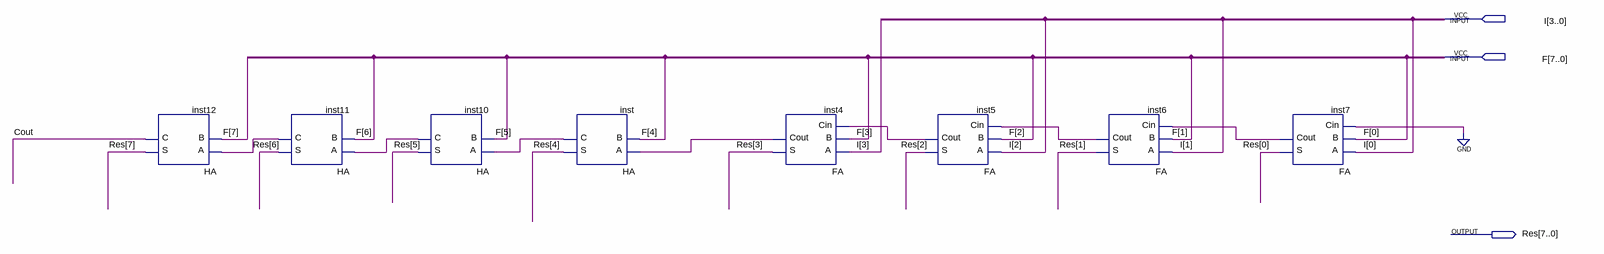
[diagram p0: schematic sheet]
// Quartus schematic Adder8_4bits.bdf as structural Verilog: 8 symbols, 3 pins
module Adder8_4bits (
  input  [3:0] I,
  input  [7:0] F,
  output [7:0] Res
);

  wire Cout, inst4_cout, inst5_cout, inst6_cout, inst7_cout, inst10_c, inst11_c, inst_c;

  HA inst12 (.A(inst11_c), .B(F[7]), .S(Res[7]), .C(Cout));
  HA inst11 (.A(inst10_c), .B(F[6]), .S(Res[6]), .C(inst11_c));
  HA inst10 (.A(inst_c), .B(F[5]), .S(Res[5]), .C(inst10_c));
  HA inst (.A(inst4_cout), .B(F[4]), .S(Res[4]), .C(inst_c));
  FA inst4 (.A(I[3]), .B(F[3]), .Cin(inst5_cout), .S(Res[3]), .Cout(inst4_cout));
  FA inst5 (.A(I[2]), .B(F[2]), .Cin(inst6_cout), .S(Res[2]), .Cout(inst5_cout));
  FA inst6 (.A(I[1]), .B(F[1]), .Cin(inst7_cout), .S(Res[1]), .Cout(inst6_cout));
  FA inst7 (.A(I[0]), .B(F[0]), .Cin(1'b0), .S(Res[0]), .Cout(inst7_cout));
endmodule
